# Altium schematic sheet Relays.SchDoc
size A4
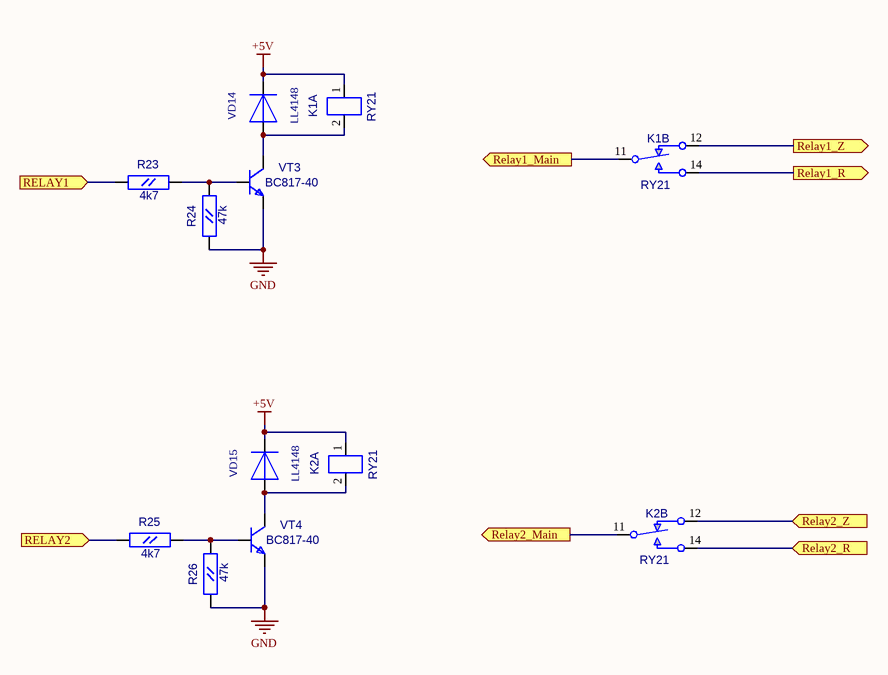
[diagram p0: Relays.SchDoc]

## Parts
K1  RY21  [RY21_RY21(Primary)]  (parts A,B of 2)
K2  RY21  [RY21_RY21(Primary)]  (parts A,B of 2)
R23  4k7  [RC0603]
R24  47k  [RC0603]
R25  4k7  [RC0603]
R26  47k  [RC0603]
VD14  LL4148  [SOD-80]
VD15  LL4148  [SOD-80]
VT3  BC817-40  [SOT-23(123)]
VT4  BC817-40  [SOT-23(123)]

## Ports
RELAY1 (in), Relay1_Main (out), Relay1_R (out), Relay1_Z (out), RELAY2 (in), Relay2_Main (out), Relay2_R (in), Relay2_Z (in)

## Nets
+5V: K1.1(L1) K2.1(L1) VD14.2(+) VD15.2(+)
GND: R24.1(A) R26.1(A) VT3.2(E) VT4.2(E)
RELAY1: R23.1(A) ; port RELAY1
Relay1_Main: K1.11(C1) ; port Relay1_Main
Relay1_R: K1.14(C2) ; port Relay1_R
Relay1_Z: K1.12(C3) ; port Relay1_Z
RELAY2: R25.1(A) ; port RELAY2
Relay2_Main: K2.11(C1) ; port Relay2_Main
Relay2_R: K2.14(C2) ; port Relay2_R
Relay2_Z: K2.12(C3) ; port Relay2_Z
NetK1_2: K1.2(C2) VD14.1(-) VT3.3(C)
NetK2_2: K2.2(C2) VD15.1(-) VT4.3(C)
NetR23_2: R23.2(B) R24.2(B) VT3.1(B)
NetR25_2: R25.2(B) R26.2(B) VT4.1(B)

## Library data of the parts
R23-R26 = RC0603
  R23 R25: Value: 4k7
  R24 R26: Value: 47k
VT3 VT4 = BC846BLT1: Value: {Value}; ComponentField7: Published 29-Sep-2000; OriginalName: BC846BLT1
K1 K2 = RY21: Value: *
VD14 VD15 = LL4148: Value: *